# Altium schematic sheet DAC_ADC.SchDoc: DAC ADC
size A3; Author: M.Beldyga; CompanyName: WUT ISE; DrawnBy: M.Beldyga; Organization: WUT ISE; Address1: PW ISE; Address2: Nowowiejska 15/19 00-665 Warsaw; Address3: micbeldyga@gmail.com; SheetNumber: 5; SheetTotal: 9; ModifiedBy: -; CheckedDate: -; DivGrp: WUT ISE; Designer: M.Beldyga; ModifiedDate: -; ProjectName: Sensor Box
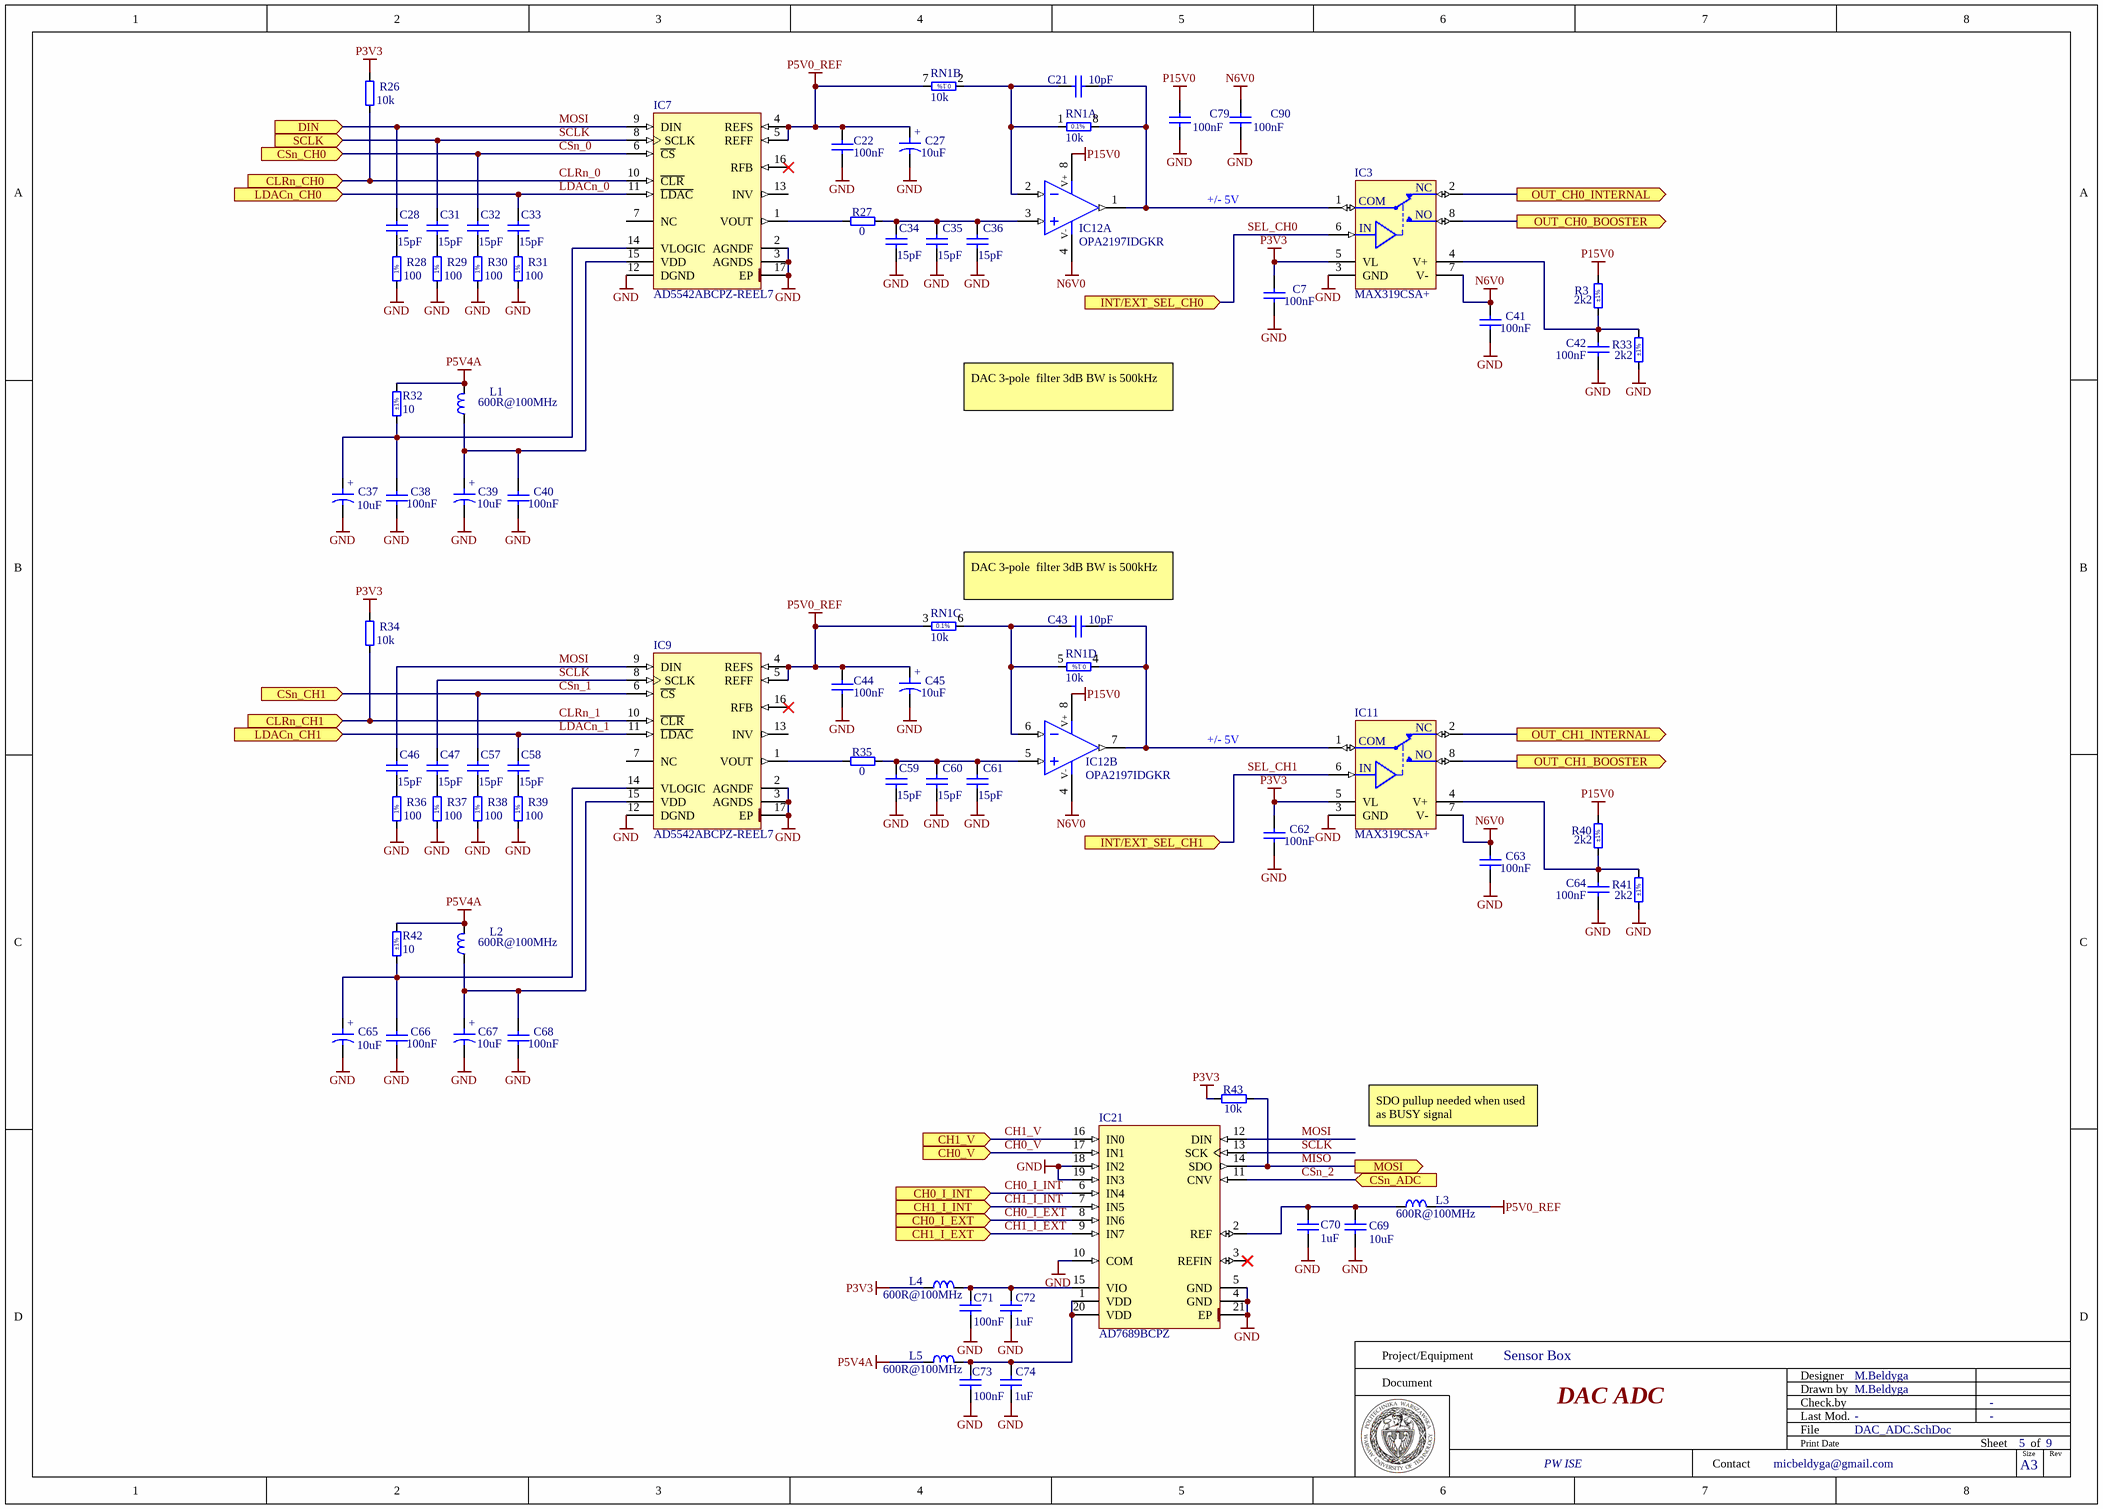
[diagram p0: DAC_ADC.SchDoc]

## Parts
C7  100nF  [CAPC1005X55N]
C21  10pF  [CAPC1005X55N]
C22  100nF  [CAPC1005X55N]
C27  10uF  [CAPMP3216X180N]
C28  15pF  [CAPC1005X55N]
C31  15pF  [CAPC1005X55N]
C32  15pF  [CAPC1005X55N]
C33  15pF  [CAPC1005X55N]
C34  15pF  [CAPC1005X55N]
C35  15pF  [CAPC1005X55N]
C36  15pF  [CAPC1005X55N]
C37  10uF  [CAPMP3216X180N]
C38  100nF  [CAPC1005X55N]
C39  10uF  [CAPMP3216X180N]
C40  100nF  [CAPC1005X55N]
C41  100nF  [CAPC1005X55N]
C42  100nF  [CAPC1005X55N]
C43  10pF  [CAPC1005X55N]
C44  100nF  [CAPC1005X55N]
C45  10uF  [CAPMP3216X180N]
C46  15pF  [CAPC1005X55N]
C47  15pF  [CAPC1005X55N]
C57  15pF  [CAPC1005X55N]
C58  15pF  [CAPC1005X55N]
C59  15pF  [CAPC1005X55N]
C60  15pF  [CAPC1005X55N]
C61  15pF  [CAPC1005X55N]
C62  100nF  [CAPC1005X55N]
C63  100nF  [CAPC1005X55N]
C64  100nF  [CAPC1005X55N]
C65  10uF  [CAPMP3216X180N]
C66  100nF  [CAPC1005X55N]
C67  10uF  [CAPMP3216X180N]
C68  100nF  [CAPC1005X55N]
C69  10uF  [CAPC1608X80N]
C70  1uF  [CAPC1608X87N]
C71  100nF  [CAPC1005X55N]
C72  1uF  [CAPC1608X87N]
C73  100nF  [CAPC1005X55N]
C74  1uF  [CAPC1608X87N]
C79  100nF  [CAPC1005X55N]
C90  100nF  [CAPC1005X55N]
IC3  MAX319CSA+  [SOIC127P600X175-8N]
IC7  AD5542ABCPZ-REEL7  [QFN50P300X300X80-17N-S175]
IC9  AD5542ABCPZ-REEL7  [QFN50P300X300X80-17N-S175]
IC11  MAX319CSA+  [SOIC127P600X175-8N]
IC12  OPA2197IDGKR  [SOP65P490X110-8N]  (parts A,B of 2)
IC21  AD7689BCPZ  [QFN50P400X400X80-21N-S265]
L1  600R@100MHz  [INDC1005X55N]
L2  600R@100MHz  [INDC1005X55N]
L3  600R@100MHz  [INDC1005X55N]
L4  600R@100MHz  [INDC1005X55N]
L5  600R@100MHz  [INDC1005X55N]
R3  2k2  Tolerance: ±1%  [RESC1005X40N]
R26  10k  [RESC1005X35N]
R27  0  [RESC1005X40N]
R28  100  [RESC1005X40N]
R29  100  [RESC1005X40N]
R30  100  [RESC1005X40N]
R31  100  [RESC1005X40N]
R32  10  Tolerance: ±1%  [RESC1005X40N]
R33  2k2  Tolerance: ±1%  [RESC1005X40N]
R34  10k  [RESC1005X35N]
R35  0  [RESC1005X40N]
R36  100  [RESC1005X40N]
R37  100  [RESC1005X40N]
R38  100  [RESC1005X40N]
R39  100  [RESC1005X40N]
R40  2k2  Tolerance: ±1%  [RESC1005X40N]
R41  2k2  Tolerance: ±1%  [RESC1005X40N]
R42  10  Tolerance: ±1%  [RESC1005X40N]
R43  10k  [RESC1005X35N]
RN1  10k  [SOIC127P600X175-8N]  (parts A,B,C,D of 4)

## Ports
CH0_I_EXT (in), CH0_I_INT (in), CH0_V (in), CH1_I_EXT (in), CH1_I_INT (in), CH1_V (in), CLRn_CH0 (in), CLRn_CH1 (in), CSn_ADC (in), CSn_CH0 (in), CSn_CH1 (in), DIN (in), INT/EXT_SEL_CH0 (in), INT/EXT_SEL_CH1 (in), LDACn_CH0 (in), LDACn_CH1 (in), MOSI (out), OUT_CH0_BOOSTER (out), OUT_CH0_INTERNAL (out), OUT_CH1_BOOSTER (out), OUT_CH1_INTERNAL (out), SCLK (in)

## Nets
GND: C7.1 C22.1 C27.2 C34.1 C35.1 C36.1 C37.2 C38.1 C39.2 C40.1 C41.1 C42.1 C44.1 C45.2 C59.1 C60.1 C61.1 C62.1 C63.1 C64.1 C65.2 C66.1 C67.2 C68.1 C69.1 C70.1 C71.1 C72.1 C73.1 C74.1 C79.1 C90.1 IC3.3(GND) IC7.2(AGNDF) IC7.3(AGNDS) IC7.12(DGND) IC7.17(EP) IC9.2(AGNDF) IC9.3(AGNDS) IC9.12(DGND) IC9.17(EP) IC11.3(GND) IC21.4(GND) IC21.5(GND) IC21.10(COM) IC21.18(IN2) IC21.19(IN3) IC21.21(EP) R28.1 R29.1 R30.1 R31.1 R33.1 R36.1 R37.1 R38.1 R39.1 R41.1
N6V0: C41.2 C63.2 C90.2 IC3.7(V-) IC11.7(V-) IC12.4(V-)
P3V3: C7.2 C62.2 IC3.5(VL) IC11.5(VL) L4.1 R26.2 R34.2 R43.1
P5V0_REF: C22.2 C27.1 C44.2 C45.1 IC7.4(REFS) IC7.5(REFF) IC9.4(REFS) IC9.5(REFF) L3.1 RN1.3 RN1.7
P5V4A: L1.2 L2.2 L5.1 R32.2 R42.2
P15V0: C79.2 IC12.8(V+) R3.2 R40.2
CH0_I_EXT: IC21.8(IN6) ; port CH0_I_EXT
CH0_I_INT: IC21.6(IN4) ; port CH0_I_INT
CH0_V: IC21.17(IN1) ; port CH0_V
CH1_I_EXT: IC21.9(IN7) ; port CH1_I_EXT
CH1_I_INT: IC21.7(IN5) ; port CH1_I_INT
CH1_V: IC21.16(IN0) ; port CH1_V
CLRn_0: IC7.10(~{CLR}) R26.1 ; port CLRn_CH0
CLRn_1: IC9.10(~{CLR}) R34.1 ; port CLRn_CH1
CSn_0: C32.2 IC7.6(~{CS}) ; port CSn_CH0
CSn_1: C57.2 IC9.6(~{CS}) ; port CSn_CH1
CSn_2: IC21.11(CNV) ; port CSn_ADC
LDACn_0: C33.2 IC7.11(~{LDAC}) ; port LDACn_CH0
LDACn_1: C58.2 IC9.11(~{LDAC}) ; port LDACn_CH1
MISO: IC21.14(SDO) R43.2 ; port MOSI
MOSI: C28.2 C46.2 IC7.9(DIN) IC9.9(DIN) IC21.12(DIN) ; port DIN
OUT_CH0_BOOSTER: IC3.8(NO) ; port OUT_CH0_BOOSTER
OUT_CH0_INTERNAL: IC3.2(NC) ; port OUT_CH0_INTERNAL
OUT_CH1_BOOSTER: IC11.8(NO) ; port OUT_CH1_BOOSTER
OUT_CH1_INTERNAL: IC11.2(NC) ; port OUT_CH1_INTERNAL
SCLK: C31.2 C47.2 IC7.8(SCLK) IC9.8(SCLK) IC21.13(SCK) ; port SCLK
SEL_CH0: IC3.6(IN) ; port INT/EXT_SEL_CH0
SEL_CH1: IC11.6(IN) ; port INT/EXT_SEL_CH1
NetC21_1: C21.1 IC12.2(IN-) RN1.1 RN1.2
NetC21_2: C21.2 IC3.1(S) IC12.1(OUT) RN1.8
NetC28_1: C28.1 R28.2
NetC31_1: C31.1 R29.2
NetC32_1: C32.1 R30.2
NetC33_1: C33.1 R31.2
NetC34_2: C34.2 C35.2 C36.2 IC12.3(IN+) R27.2
NetC37_1: C37.1 C38.2 IC7.14(VLOGIC) R32.1
NetC39_1: C39.1 C40.2 IC7.15(VDD) L1.1
NetC42_2: C42.2 IC3.4(V+) R3.1 R33.2
NetC43_1: C43.1 IC12.6(IN-) RN1.5 RN1.6
NetC43_2: C43.2 IC11.1(S) IC12.7(OUT) RN1.4
NetC46_1: C46.1 R36.2
NetC47_1: C47.1 R37.2
NetC57_1: C57.1 R38.2
NetC58_1: C58.1 R39.2
NetC59_2: C59.2 C60.2 C61.2 IC12.5(IN+) R35.2
NetC64_2: C64.2 IC11.4(V+) R40.1 R41.2
NetC65_1: C65.1 C66.2 IC9.14(VLOGIC) R42.1
NetC67_1: C67.1 C68.2 IC9.15(VDD) L2.1
NetC69_2: C69.2 C70.2 IC21.2(REF) L3.2
NetC71_2: C71.2 C72.2 IC21.15(VIO) L4.2
NetC73_2: C73.2 C74.2 IC21.1(VDD) IC21.20(VDD) L5.2
NetIC7_1: IC7.1(VOUT) R27.1
NetIC9_1: IC9.1(VOUT) R35.1

Not connected (* = marked no-connect by the designer): IC7 7(NC) 13(INV) 16(RFB)*; IC9 7(NC) 13(INV) 16(RFB)*; IC21 3(REFIN)*

## Notes on the sheet
- +/- 5V
- DAC 3-pole  filter 3dB BW is 500kHz
- SDO pullup needed when used as BUSY signal
- Project/Equipment
- Document
- Designer
- Drawn by
- Check.by
- Contact
- File
- Last Mod.
- Print Date
- Sheet
- Size
- A3
- of
- Rev
- (in symbol CTE3216-18_10UF_16V_20%_AVX_TCJ) +
- (in symbol MAX319CSA+) COM
- (in symbol R0402_100R_1%_0.0625W_100PPM) 1%
- (in symbol RN_10K_VISHAY_AORN1002A, part A) 0.1%
- (in symbol RN_10K_VISHAY_AORN1002A, part B) 0.1%
- (in symbol RN_10K_VISHAY_AORN1002A, part C) 0.1%
- (in symbol RN_10K_VISHAY_AORN1002A, part D) 0.1%

## Library data of the parts
C7 C22 C38 C40-C42 C44 C62-C64 C66 C68 C71 C73 C79 C90 = CC0402_100NF_16V_10%_X5R: Non-polarised capacitor; Part Description: SMD Multilayer Chip Ceramic Capacitor; Manufacturer: GENERIC; Manufacturer1 Part Number: GRM155R61C104KA88D; Voltage: 16V; TC: X5R; Tolerance: ±10%; Part Number: CC0402_100NF_16V_10%_X5R; Component Kind: Standard; Component Type: Standard; Pin Count: 2; Value: 100nF; Status: None; Manufacturer Part Number: CC0402_100NF_16V_10%_X5R; Case: 0402; Mounted: Yes; Socket: No; SMD: Yes; Sense: No; Manufacturer1 Example: MURATA; Manufacturer1 ComponentHeight: 0.55mm; HelpURL: \\cern.ch\dfs\Applications\Altium\Datasheets\CC0402_X5R_MURATA_GRM.pdf; Author: CERN DEM JLC; CreateDate: 10.12.2013; LatestRevisionDate: 10.12.2013
C21 C43 = CC0402_10PF_50V_5%_C0G: Non-polarised capacitor; Part Description: SMD Multilayer Chip Ceramic Capacitor; Manufacturer: GENERIC; Manufacturer1 Part Number: C0402C100J5GACTU; Voltage: 50V; TC: C0G/NP0; Tolerance: ±5%; Part Number: CC0402_10PF_50V_5%_C0G; Component Kind: Standard; Component Type: Standard; Pin Count: 2; Value: 10pF; Status: Preferred; Manufacturer Part Number: CC0402_10PF_50V_5%_C0G; Case: 0402; Mounted: Yes; Socket: No; SMD: Yes; Sense: No; Manufacturer1 Example: KEMET; Manufacturer1 ComponentHeight: 0.55mm; HelpURL: \\cern.ch\dfs\Applications\Altium\Datasheets\CC0805_C0G_KEMET_(Commercial Grade).pdf; Author: CERN DEM JLC; CreateDate: 03.12.2007; LatestRevisionDate: 22.04.2015
C27 C37 C39 C45 C65 C67 = CTE3216-18_10UF_16V_20%_AVX_TCJ: Polarised capacitor; Part Description: ESR 0R200 Tantalum Solid Electrolytic Chip Capacitor with Conductive Polymer Electrode; Manufacturer: AVX; Manufacturer Part Number: TCJA106M016R0200 or  or TR3A106K016C1700; Manufacturer1 Part Number: TCJA106M016R0200; Voltage: 16V; Tolerance: ±20%; Part Number: CTE3216-18_10UF_16V_20%_AVX_TCJ; Component Kind: Standard; Component Type: Standard; Pin Count: 2; Value: 10uF; Status: Preferred; Case: A; Mounted: Yes; Socket: No; SMD: Yes; Sense: No; HelpURL: \\cern.ch\dfs\Applications\Altium\Datasheets\CTE_AVX_TCJ.pdf; Author: CERN DEM JLC; CreateDate: 29.03.2012; LatestRevisionDate: 29.03.2012; ComponentHeight: 1.8mm
C28 C31-C36 C46 C47 C57-C61 = CC0402_15PF_50V_5%_C0G: Non-polarised capacitor; Part Description: SMD Multilayer Chip Ceramic Capacitor; Manufacturer: GENERIC; Manufacturer1 Part Number: C0402C150J5GACTU; Voltage: 50V; TC: C0G/NP0; Tolerance: ±5%; Part Number: CC0402_15PF_50V_5%_C0G; Component Kind: Standard; Component Type: Standard; Pin Count: 2; Value: 15pF; Status: Preferred; Manufacturer Part Number: CC0402_15PF_50V_5%_C0G; Case: 0402; Mounted: Yes; Socket: No; SMD: Yes; Sense: No; Manufacturer1 Example: KEMET; Manufacturer1 ComponentHeight: 0.55mm; HelpURL: \\cern.ch\dfs\Applications\Altium\Datasheets\CC0402_C0G_KEMET_(Commercial Grade).pdf; Author: CERN DEM JLC; CreateDate: 12/3/2007; LatestRevisionDate: 4/22/2015
C69 = CC0603_10UF_16V_20%_X5R: Non-polarised capacitor; Part Description: SMD Multilayer Chip Ceramic Capacitor; Manufacturer: GENERIC; Manufacturer1 Part Number: GRM188R61C106MA73D; Voltage: 16V; TC: X5R; Tolerance: ±20%; Part Number: CC0603_10UF_16V_20%_X5R; Component Kind: Standard; Component Type: Standard; Pin Count: 2; Value: 10uF; Status: None; Manufacturer Part Number: CC0603_10UF_16V_20%_X5R; Case: 0603; Mounted: Yes; Socket: No; SMD: Yes; Sense: No; Manufacturer1 Example: MURATA; Manufacturer1 ComponentHeight: 0.8mm; HelpURL: \\cern.ch\dfs\Applications\Altium\Datasheets\CC0603_X5R_MURATA_GRM.pdf; Author: CERN DEM MR; CreateDate: 02.03.2016; LatestRevisionDate: 02.03.2016
C70 C72 C74 = CC0603_1UF_25V_10%_X7R: Non-polarised capacitor; Part Description: SMD Multilayer Chip Ceramic Capacitor; Manufacturer: GENERIC; Manufacturer1 Part Number: GCM188R71E105KA64D; Voltage: 25V; TC: X7R; Tolerance: ±10%; Part Number: CC0603_1UF_25V_10%_X7R; Component Kind: Standard; Component Type: Standard; Pin Count: 2; Value: 1uF; Status: None; Manufacturer Part Number: CC0603_1UF_25V_10%_X7R; Case: 0603; Mounted: Yes; Socket: No; SMD: Yes; Sense: No; Manufacturer1 Example: MURATA; Manufacturer1 ComponentHeight: 0.9mm; HelpURL: \\cern.ch\dfs\Applications\Altium\Datasheets\CC0603_X7R_MURATA.pdf; Author: CERN DEM JLC; CreateDate: 18.01.2011; LatestRevisionDate: 18.01.2011
IC3 IC11 = MAX319CSA+: Precision, Single SPDT CMOS Analog Switch; Manufacturer: MAXIM; PressFit: No; Bonding: No; Part Number: MAX319CSA+; Component Kind: Standard; Component Type: Standard; Device: MAX319CSA+; PackageDescription: SOIC 8, Pitch 1.27mm, Body 4x5mm, IPC Medium Density; Part Description: Precision, Single SPDT CMOS Analog Switch; Manufacturer Part Number: MAX319CSA; Pin Count: 8; Case: SOIC8; Mounted: Yes; Socket: No; SMD: Yes; Sense: No; ComponentHeight: 1.75mm; Author: CERN DEM JLC; HelpURL: \\cern.ch\dfs\Applications\Altium\Datasheets\MAX319CSA+.pdf; CreateDate: 4/26/2011; LatestRevisionDate: 4/4/2022
IC7 IC9 = AD5542ABCPZ-REEL7: 2.7V to 5.5V, Serial-Input, Voltage-Output, 16-Bit DAC; Manufacturer: ANALOG DEVICES; PressFit: No; Bonding: No; Part Number: AD5542ABCPZ-REEL7; Component Kind: Standard; Component Type: Standard; Device: AD5542ABCPZ-REEL7; PackageDescription: QFN, 0.50mm Pitch, Square; 16 Pin, 3.00mm L X 3.00mm W X 0.80mm H body (w/Thermal Tab 1.75 X 1.75mm), IPC Medium Density; Part Description: 2.7V to 5.5V, Serial-Input, Voltage-Output, 16-Bit DAC; Manufacturer Part Number: AD5542ABCP; Pin Count: 17; Case: QFN16; Mounted: Yes; Socket: No; SMD: Yes; Sense: No; ComponentHeight: 0.8mm; Author: CERN DEM JLC; HelpURL: \\cern.ch\dfs\Applications\Altium\Datasheets\AD5542ABCPZ-REEL7.pdf; CreateDate: 11/29/2018; LatestRevisionDate: 3/23/2022
IC12 = OA_OPA2197IDGKR: 36-V, Precision, Rail-to-Rail Input Output, Low Offset Voltage Op Amp 8-VSSOP; Part Description: High-Precision, Low-Noise, Rail-to-Rail Output,10-MHz Op Amp; Manufacturer1: TEXAS INSTRUMENTS; PressFit: No; Bonding: No; Part Number: OPA2197IDGKR; Component Kind: Standard; Component Type: Standard; Device: OPA2197IDGKR; PackageDescription: SOP, 0.65mm pitch; 8 pin, 3.00mm W X 3.00mm L X 1.10mm H body, IPC Medium Density; Manufacturer1 Part Number: OPA2197IDGKR; Pin Count: 8; Case: MSOP8; Mounted: Yes; Socket: No; SMD: Yes; Sense: No; ComponentHeight: 1.1mm; Author: GK; HelpURL: \\cern.ch\dfs\Applications\Altium\Datasheets\OPA2140AIDGK.pdf; CreateDate: 20.04.2017; LatestRevisionDate: 20.04.2017
IC21 = AD7689BCPZ: 16-Bit, 8-Channel, 250 kSPS PulSAR ADC; Part Description: 16-Bit, ±1.5 LSB INL, 8-Channel, 250 kSPS PulSAR ADC; Manufacturer: ANALOG DEVICES; PressFit: No; Bonding: No; Part Number: AD7689BCPZ; Component Kind: Standard; Component Type: Standard; Device: AD7689BCPZ; PackageDescription: QFN, 0.50mm Pitch, Square; 20 Pin, 4.00mm L X 4.00mm W X 0.80mm H Body (w/Thermal Tab 2.75 X 2.75mm), IPC Medium Density; Manufacturer Part Number: AD7689BCP; Pin Count: 21; Case: QFN20; Mounted: Yes; Socket: No; SMD: Yes; Sense: No; ComponentHeight: 0.8mm; Author: CERN DEM BC; HelpURL: \\cern.ch\dfs\Applications\Altium\Datasheets\AD7689BCPZ.pdf; CreateDate: 3/15/2021; LatestRevisionDate: 3/22/2022
L1-L5 = IND0402_MURATA_BLM15HD601SN1: Inductor; Part Description: SMD EMIFIL Suppression Chip Ferrite Bead; Manufacturer1: MURATA; Manufacturer1 Part Number: BLM15HD601SN1D; Power: 300mA; Resistance: 0.85R; Tolerance: ±25%; Part Number: IND0402_MURATA_BLM15HD601SN1; Component Kind: Standard; Component Type: Standard; Pin Count: 2; Value: 600R@100MHz; Status: None; Case: 0402; Mounted: Yes; Socket: No; SMD: Yes; Sense: No; ComponentHeight: 0.55mm; HelpURL: \\cern.ch\dfs\Applications\Altium\Datasheets\IND0402_MURATA_BLM15H.pdf; Author: CERN DEM JLC; CreateDate: 28/02/2012; LatestRevisionDate: 28/02/2012
R3 R33 R40 R41 = R0402_2K2_1%_0.0625W_100PPM: Resistor - 1%; Part Description: General Purpose Thick Film Chip Resistor; Manufacturer: GENERIC; Manufacturer1 Part Number: 232270672202L; TC: ±100ppm/°C; PressFit: No; Part Number: R0402_2K2_1%_0.0625W_100PPM; Component Kind: Standard; Component Type: Standard; Pin Count: 2; Value: 2k2; Status: Not Recommended; Power: 0.0625W; Manufacturer Part Number: R0402_2K2_1%_0.0625W_100PPM; Case: 0402; Mounted: Yes; Sense: No; Socket: No; SMD: Yes; Manufacturer1 ComponentHeight: 0.4mm; HelpURL: \\cern.ch\dfs\Applications\Altium\Datasheets\R0402_Phycomp_RC0402.pdf; Author: CERN DEM JLC; CreateDate: 12/3/2007; LatestRevisionDate: 10/17/2012; Manufacturer1 Example: YAGEO PHYCOMP
R26 R34 R43 = R0402_10K_0.1%_0.063W_25PPM: Resistor - 0.1%; Part Description: Thin Film Precision Resistor; Manufacturer: GENERIC; Manufacturer1 Part Number: CPF0402B10KE1; Power: 0.063W; TC: ±25ppm/°C; PressFit: No; Part Number: R0402_10K_0.1%_0.063W_25PPM; Component Kind: Standard; Component Type: Standard; Pin Count: 2; Value: 10k; Status: Not Recommended; Tolerance: ±0.1%; Manufacturer Part Number: R0402_10K_0.1%_0.063W_25PPM; Case: 0402; Mounted: Yes; Sense: No; Socket: No; SMD: Yes; Manufacturer1 ComponentHeight: 0.35mm; HelpURL: \\cern.ch\dfs\Applications\Altium\Datasheets\R0402_TYCO_CPF.pdf; Author: CERN DEM JMW; CreateDate: 9/22/2015; LatestRevisionDate: 9/22/2015; Manufacturer1 Example: TE CONNECTIVITY
R27 R35 = R0402_0R_JUMPER: Resistor; Part Description: 1A (0.05R Max DC Resistance) Zero Ohm Jumper; Manufacturer: GENERIC; Manufacturer1: Vishay; Manufacturer1 Part Number: CRCW04020000Z0EDC; PressFit: No; Part Number: R0402_0R_JUMPER; Component Kind: Standard; Component Type: Standard; Pin Count: 2; Value: 0; Status: Not Recommended; Manufacturer Part Number: R0402_0R_JUMPER; Case: 0402; Mounted: Yes; Sense: No; Socket: No; SMD: Yes; Manufacturer1 ComponentHeight: 0.4mm; HelpURL: \\cern.ch\dfs\Applications\Altium\Datasheets\R0402_Phycomp_RC0402.pdf; Author: CERN DEM JLC; CreateDate: 03.12.2007; LatestRevisionDate: 17.10.2012
R28-R31 R36-R39 = R0402_100R_1%_0.0625W_100PPM: Resistor - 1%; Part Description: General Purpose Thick Film Chip Resistor; Manufacturer: GENERIC; Manufacturer1: Vishay; Manufacturer1 Part Number: RCA0402100RFKED; TC: ±100ppm/°C; PressFit: No; Part Number: R0402_100R_1%_0.0625W_100PPM; Component Kind: Standard; Component Type: Standard; Pin Count: 2; Value: 100; Status: Not Recommended; Power: 0.0625W; Tolerance: ±1%; Manufacturer Part Number: R0402_100R_1%_0.0625W_100PPM; Case: 0402; Mounted: Yes; Sense: No; Socket: No; SMD: Yes; Manufacturer1 ComponentHeight: 0.4mm; HelpURL: \\cern.ch\dfs\Applications\Altium\Datasheets\R0402_Phycomp_RC0402.pdf; Author: CERN DEM JLC; CreateDate: 03.12.2007; LatestRevisionDate: 17.10.2012
R32 R42 = R0402_10R_1%_0.0625W_200PPM: Resistor - 1%; Part Description: General Purpose Thick Film Chip Resistor; Manufacturer: GENERIC; Manufacturer1 Part Number: 232270671009L; TC: ±200ppm/°C; PressFit: No; Part Number: R0402_10R_1%_0.0625W_200PPM; Component Kind: Standard; Component Type: Standard; Pin Count: 2; Value: 10; Status: Not Recommended; Power: 0.0625W; Manufacturer Part Number: R0402_10R_1%_0.0625W_200PPM; Case: 0402; Mounted: Yes; Sense: No; Socket: No; SMD: Yes; Manufacturer1 Example: YAGEO PHYCOMP; Manufacturer1 ComponentHeight: 0.4mm; HelpURL: \\cern.ch\dfs\Applications\Altium\Datasheets\R0402_Phycomp_RC0402.pdf; Author: CERN DEM JLC; CreateDate: 6/24/2009; LatestRevisionDate: 10/17/2012
RN1 = RN_10K_VISHAY_AORN1002A: DIL8 Resistor Network 4 Isolated Resistor 0.1%; Part Description: Dual-In-Line Thin Film Precision Automotive Resistors Network, (4 Isolated) - AORN Series; Manufacturer: VISHAY DALE; Power: 4x0.1W; TC: ±25ppm/°C; PressFit: No; Part Number: RN_10K_VISHAY_AORN1002A; Component Kind: Standard; Component Type: Standard; Pin Count: 8; Value: 10k; Sense: No; Tolerance: ±0.1%; Manufacturer Part Number: AORN1002A; Case: SOIC8; Mounted: Yes; Socket: No; SMD: Yes; ComponentHeight: 1.73mm; HelpURL: \\cern.ch\dfs\Applications\Altium\Datasheets\RN_VISHAY_AORN.pdf; Author: CERN DEM JLC; CreateDate: 2/20/2017; LatestRevisionDate: 5/3/2017